# Altium schematic sheet Sheet2 - Moteur.SchDoc
size A4; DocumentNumber: 1; SheetNumber: 2
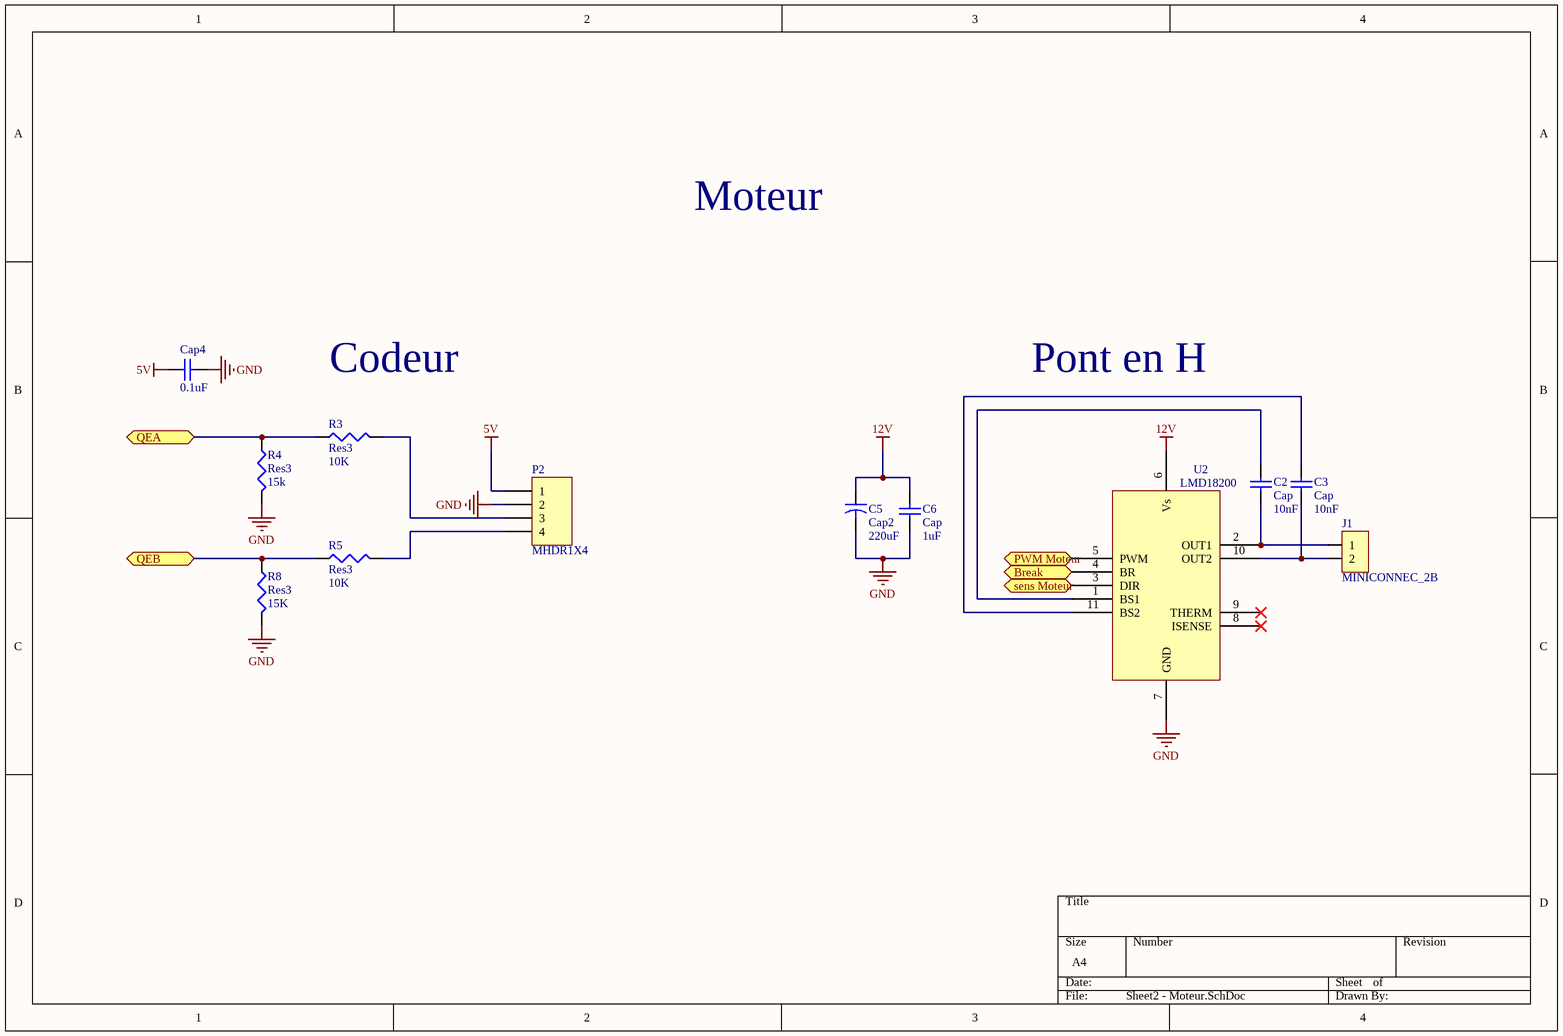
[diagram p0: Sheet2 - Moteur.SchDoc]

## Parts
C2  Cap  value 10nF  [RAD-0.3]
C3  Cap  value 10nF  [RAD-0.3]
C5  Cap2  value 220uF  [CAPR5-4X5]
C6  Cap  value 1uF  [RAD-0.3]
Cap4  0.1uF  [RAD-0.3]
J1  MINICONNEC_2B  [MINICONNEC_C]
P2  MHDR1X4  [MHDR1X4]
R3  Res3  value 10K  [RESC1608L]
R4  Res3  value 15k  [RESC1608L]
R5  Res3  value 10K  [RESC1608L]
R8  Res3  value 15K  [RESC1608L]
U2  LMD18200  [TA11B]  (value not drawn)

## Ports
Break (bidir), PWM Moteur (bidir), QEA (bidir), QEB (bidir), sens Moteur (bidir)

## Nets
5V: Cap4.2 P2.1
12V: C5.1 C6.2 U2.6(Vs)
GND: C5.2 C6.1 Cap4.1 P2.2 R4.2 R8.2 U2.7(GND)
Break: U2.4(BR) ; port Break
PWM Moteur: U2.5(PWM) ; port PWM Moteur
QEA: R3.1 R4.1 ; port QEA
QEB: R5.1 R8.1 ; port QEB
sens Moteur: U2.3(DIR) ; port sens Moteur
NetC2_1: C2.1 U2.1(BS1)
NetC2_2: C2.2 J1.1 U2.2(OUT1)
NetC3_1: C3.1 U2.11(BS2)
NetC3_2: C3.2 J1.2 U2.10(OUT2)
NetP2_3: P2.3 R3.2
NetP2_4: P2.4 R5.2

Not connected (* = marked no-connect by the designer): U2 8(ISENSE)* 9(THERM)*

## Notes on the sheet
- Moteur
- Codeur
- Pont en H

## Library data of the parts
C2 C3 C6 Cap4 = Cap: Capacitor; Published: 8-Jun-2000; LatestRevisionDate: 17-Jul-2002; LatestRevisionNote: Re-released for DXP Platform.; PackageReference: RAD-0.3; Publisher: Altium Limited
C5 = Cap2: Capacitor; Published: 23-Sep-2002; PackageReference: CAPR5-4X5; Publisher: Altium Limited
J1 = MINICONNEC_2B: Connecteur
P2 = MHDR1X4: Header, 4-Pin; LatestRevisionDate: 17-Jul-2002; LatestRevisionNote: Re-released for DXP Platform.; Publisher: Altium Limited
R3-R5 R8 = Res3: Resistor; Published: 8-Jun-2000; LatestRevisionDate: 29-May-2009; LatestRevisionNote: IPC-7351 Footprint Added.; PackageReference: J1-0603; Publisher: Altium Limited; PackageDescription: Chip Resistor
U2 = LMD18200: Pont-H